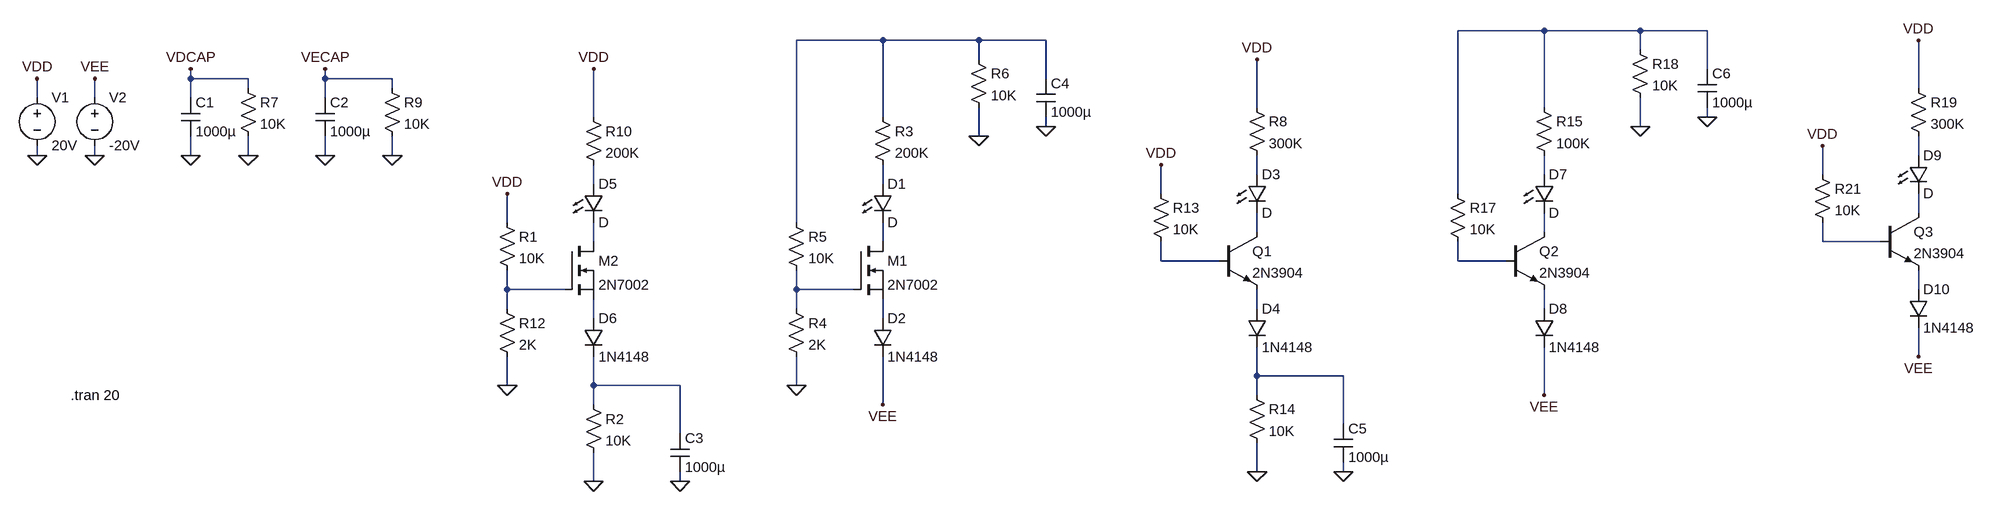
[diagram p0: schematic Signal_SSR_Switched_REV_1.asc]
Signal_SSR_Switched_REV_1.asc, the LTspice schematic file:
Version 4
SHEET 1 3908 920
WIRE 3056 -64 2912 -64
WIRE 3216 -64 3056 -64
WIRE 3328 -64 3216 -64
WIRE 1920 -48 1776 -48
WIRE 2080 -48 1920 -48
WIRE 2192 -48 2080 -48
WIRE 3216 -32 3216 -64
WIRE 2080 -16 2080 -48
WIRE 3328 0 3328 -64
WIRE 688 16 688 0
WIRE 784 16 688 16
WIRE 912 16 912 0
WIRE 1024 16 912 16
WIRE 2192 16 2192 -48
WIRE 784 32 784 16
WIRE 1024 32 1024 16
WIRE 3680 32 3680 -48
WIRE 432 48 432 16
WIRE 528 48 528 16
WIRE 688 48 688 16
WIRE 912 48 912 16
WIRE 2544 64 2544 -16
WIRE 3056 64 3056 -64
WIRE 1408 80 1408 0
WIRE 1920 80 1920 -48
WIRE 3328 80 3328 64
WIRE 2192 96 2192 80
WIRE 3216 96 3216 48
WIRE 2080 112 2080 64
WIRE 432 144 432 128
WIRE 528 144 528 128
WIRE 688 144 688 112
WIRE 784 144 784 112
WIRE 912 144 912 112
WIRE 1024 144 1024 112
WIRE 3680 144 3680 112
WIRE 2544 176 2544 144
WIRE 3056 176 3056 144
WIRE 3520 176 3520 128
WIRE 1408 192 1408 160
WIRE 1920 192 1920 160
WIRE 2384 208 2384 160
WIRE 2912 208 2912 -64
WIRE 3680 240 3680 208
WIRE 1264 256 1264 208
WIRE 1776 256 1776 -48
WIRE 2544 272 2544 240
WIRE 3056 272 3056 240
WIRE 1408 288 1408 256
WIRE 1920 288 1920 256
WIRE 3520 288 3520 256
WIRE 3616 288 3520 288
WIRE 2384 320 2384 288
WIRE 2480 320 2384 320
WIRE 2912 320 2912 288
WIRE 2992 320 2912 320
WIRE 1264 368 1264 336
WIRE 1360 368 1264 368
WIRE 1776 368 1776 336
WIRE 1872 368 1776 368
WIRE 3680 368 3680 336
WIRE 1264 400 1264 368
WIRE 1776 400 1776 368
WIRE 2544 400 2544 368
WIRE 3056 400 3056 368
WIRE 1408 416 1408 384
WIRE 1920 416 1920 384
WIRE 3680 480 3680 432
WIRE 2544 512 2544 464
WIRE 2688 512 2544 512
WIRE 1264 528 1264 480
WIRE 1408 528 1408 480
WIRE 1552 528 1408 528
WIRE 1776 528 1776 480
WIRE 2544 544 2544 512
WIRE 3056 544 3056 464
WIRE 1408 560 1408 528
WIRE 1920 560 1920 480
WIRE 2688 592 2688 512
WIRE 1552 608 1552 528
WIRE 2544 672 2544 624
WIRE 2688 672 2688 656
WIRE 1408 688 1408 640
WIRE 1552 688 1552 672
FLAG 432 144 0
FLAG 528 144 0
FLAG 432 16 VDD
FLAG 528 16 VEE
FLAG 688 144 0
FLAG 912 144 0
FLAG 688 0 VDCAP
FLAG 912 0 VECAP
FLAG 784 144 0
FLAG 1024 144 0
FLAG 1264 528 0
FLAG 1264 208 VDD
FLAG 1408 0 VDD
FLAG 1408 688 0
FLAG 1552 688 0
FLAG 1776 528 0
FLAG 2192 96 0
FLAG 1920 560 VEE
FLAG 2080 112 0
FLAG 2384 160 VDD
FLAG 2544 -16 VDD
FLAG 2544 672 0
FLAG 2688 672 0
FLAG 3328 80 0
FLAG 3056 544 VEE
FLAG 3216 96 0
FLAG 3520 128 VDD
FLAG 3680 -48 VDD
FLAG 3680 480 VEE
SYMBOL voltage 432 32 R0
WINDOW 123 0 0 Left 0
WINDOW 39 0 0 Left 0
SYMATTR InstName V1
SYMATTR Value 20V
SYMBOL voltage 528 32 R0
WINDOW 123 0 0 Left 0
WINDOW 39 0 0 Left 0
SYMATTR InstName V2
SYMATTR Value -20V
SYMBOL cap 672 48 R0
SYMATTR InstName C1
SYMATTR Value 1000µ
SYMBOL cap 896 48 R0
SYMATTR InstName C2
SYMATTR Value 1000µ
SYMBOL res 768 16 R0
SYMATTR InstName R7
SYMATTR Value 10K
SYMBOL res 1008 16 R0
SYMATTR InstName R9
SYMATTR Value 10K
SYMBOL res 1392 64 R0
SYMATTR InstName R10
SYMATTR Value 200K
SYMBOL nmos 1360 288 R0
SYMATTR InstName M2
SYMATTR Value 2N7002
SYMBOL res 1248 384 R0
SYMATTR InstName R12
SYMATTR Value 2K
SYMBOL LED 1392 192 R0
SYMATTR InstName D5
SYMBOL diode 1392 416 R0
SYMATTR InstName D6
SYMATTR Value 1N4148
SYMBOL res 1248 240 R0
SYMATTR InstName R1
SYMATTR Value 10K
SYMBOL res 1392 544 R0
SYMATTR InstName R2
SYMATTR Value 10K
SYMBOL cap 1536 608 R0
SYMATTR InstName C3
SYMATTR Value 1000µ
SYMBOL res 1904 64 R0
SYMATTR InstName R3
SYMATTR Value 200K
SYMBOL nmos 1872 288 R0
SYMATTR InstName M1
SYMATTR Value 2N7002
SYMBOL res 1760 384 R0
SYMATTR InstName R4
SYMATTR Value 2K
SYMBOL LED 1904 192 R0
SYMATTR InstName D1
SYMBOL diode 1904 416 R0
SYMATTR InstName D2
SYMATTR Value 1N4148
SYMBOL res 1760 240 R0
SYMATTR InstName R5
SYMATTR Value 10K
SYMBOL cap 2176 16 R0
SYMATTR InstName C4
SYMATTR Value 1000µ
SYMBOL res 2064 -32 R0
SYMATTR InstName R6
SYMATTR Value 10K
SYMBOL res 2528 48 R0
SYMATTR InstName R8
SYMATTR Value 300K
SYMBOL LED 2528 176 R0
SYMATTR InstName D3
SYMBOL diode 2528 400 R0
SYMATTR InstName D4
SYMATTR Value 1N4148
SYMBOL res 2368 192 R0
SYMATTR InstName R13
SYMATTR Value 10K
SYMBOL res 2528 528 R0
SYMATTR InstName R14
SYMATTR Value 10K
SYMBOL cap 2672 592 R0
SYMATTR InstName C5
SYMATTR Value 1000µ
SYMBOL res 3040 48 R0
SYMATTR InstName R15
SYMATTR Value 100K
SYMBOL LED 3040 176 R0
SYMATTR InstName D7
SYMBOL diode 3040 400 R0
SYMATTR InstName D8
SYMATTR Value 1N4148
SYMBOL res 2896 192 R0
SYMATTR InstName R17
SYMATTR Value 10K
SYMBOL cap 3312 0 R0
SYMATTR InstName C6
SYMATTR Value 1000µ
SYMBOL res 3200 -48 R0
SYMATTR InstName R18
SYMATTR Value 10K
SYMBOL npn 2480 272 R0
SYMATTR InstName Q1
SYMATTR Value 2N3904
SYMBOL npn 2992 272 R0
SYMATTR InstName Q2
SYMATTR Value 2N3904
SYMBOL res 3664 16 R0
SYMATTR InstName R19
SYMATTR Value 300K
SYMBOL LED 3664 144 R0
SYMATTR InstName D9
SYMBOL diode 3664 368 R0
SYMATTR InstName D10
SYMATTR Value 1N4148
SYMBOL res 3504 160 R0
SYMATTR InstName R21
SYMATTR Value 10K
SYMBOL npn 3616 240 R0
SYMATTR InstName Q3
SYMATTR Value 2N3904
TEXT 488 544 Left 2 !.tran 20

The netlist it stands for:
* Signal_SSR_Switched_REV_1.asc
V1 VDD 0 20V
V2 VEE 0 -20V
C1 VDCAP 0 1000µ
C2 VECAP 0 1000µ
R7 VDCAP 0 10K
R9 VECAP 0 10K
R10 VDD N006 200K
M2 N011 N016 N021 N021 2N7002
R12 N016 0 2K
D5 N006 N011 D
D6 N021 N024 1N4148
R1 VDD N016 10K
R2 N024 0 10K
C3 N024 0 1000µ
R3 N002 N007 200K
M1 N012 N017 N022 N022 2N7002
R4 N017 0 2K
D1 N007 N012 D
D2 N022 VEE 1N4148
R5 N002 N017 10K
C4 N002 0 1000µ
R6 N002 0 10K
R8 VDD N004 300K
D3 N004 N009 D
D4 N019 N023 1N4148
R13 VDD N014 10K
R14 N023 0 10K
C5 N023 0 1000µ
R15 N001 N005 100K
D7 N005 N010 D
D8 N020 VEE 1N4148
R17 N001 N015 10K
C6 N001 0 1000µ
R18 N001 0 10K
Q1 N009 N014 N019 0 2N3904
Q2 N010 N015 N020 0 2N3904
R19 VDD N003 300K
D9 N003 N008 D
D10 N018 VEE 1N4148
R21 VDD N013 10K
Q3 N008 N013 N018 0 2N3904
.model D D
.lib standard.dio
.model NPN NPN
.model PNP PNP
.lib standard.bjt
.model NMOS NMOS
.model PMOS PMOS
.lib standard.mos
.tran 20
.backanno
.end